# Altium schematic sheet Module.SchDoc
size A0
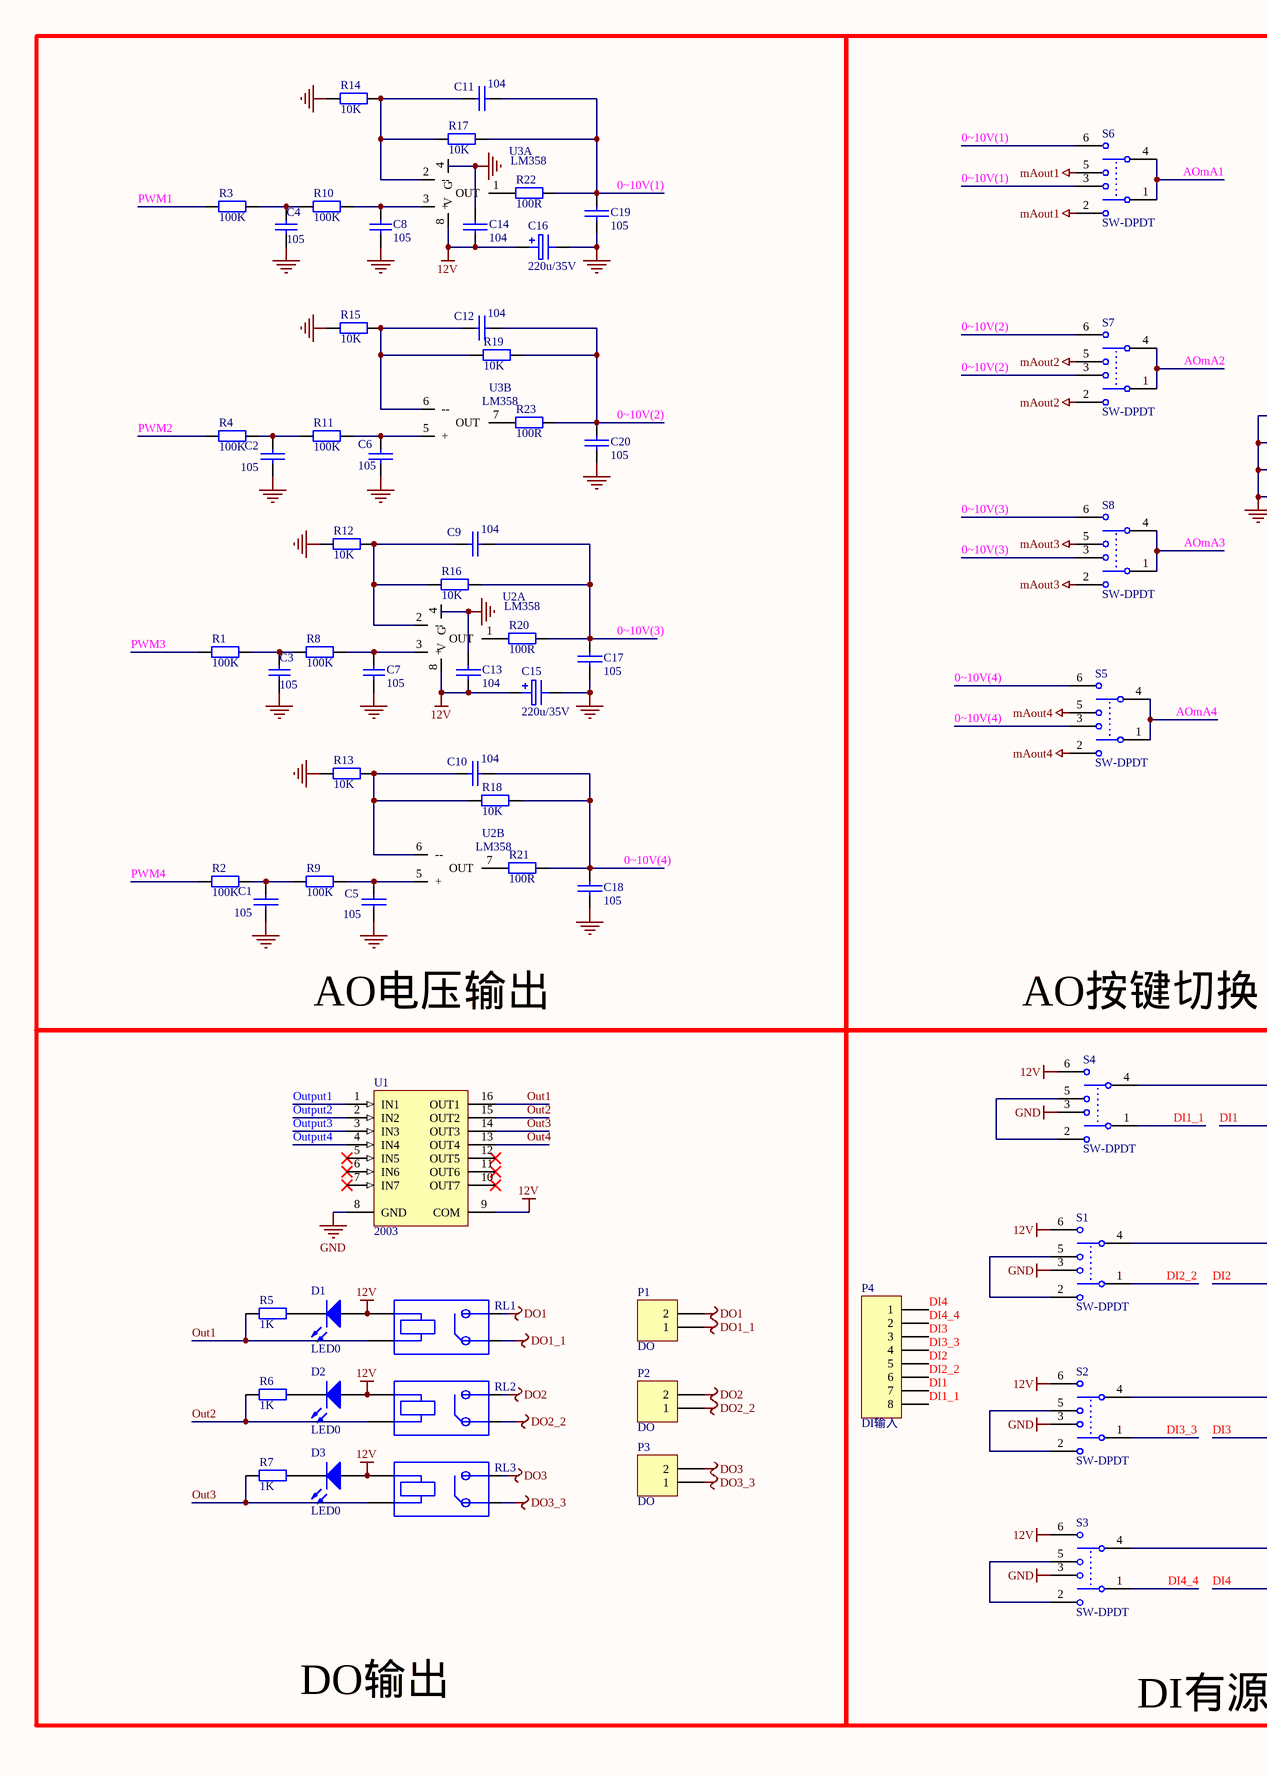
[diagram p0: Module.SchDoc, left]
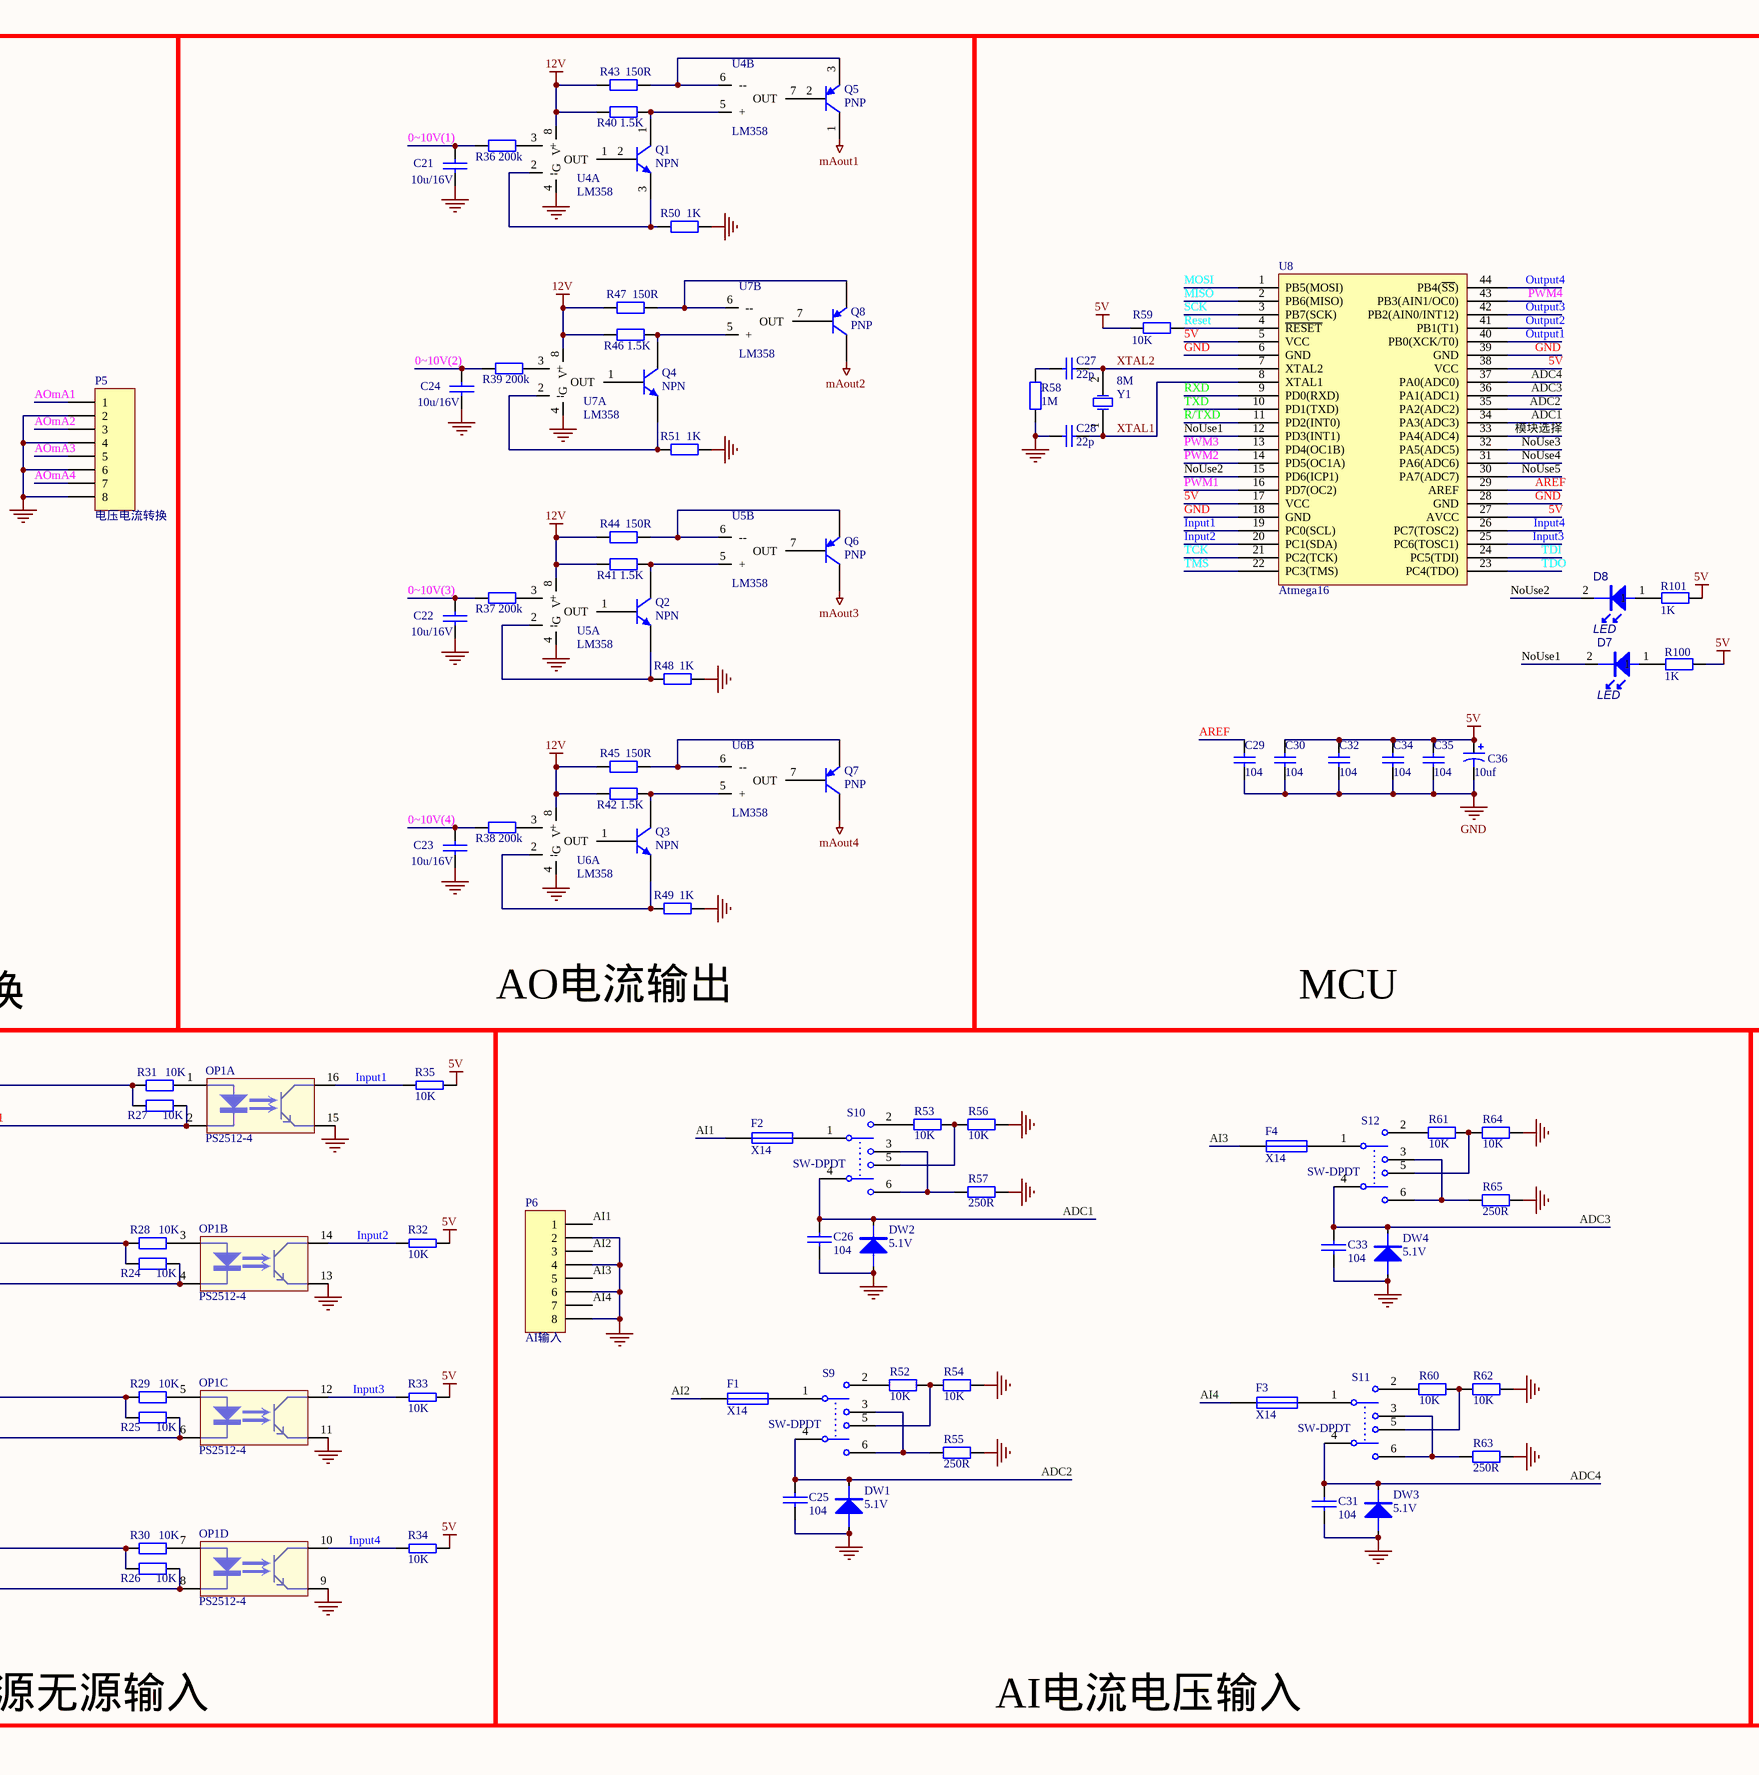
[diagram p1: Module.SchDoc, middle]
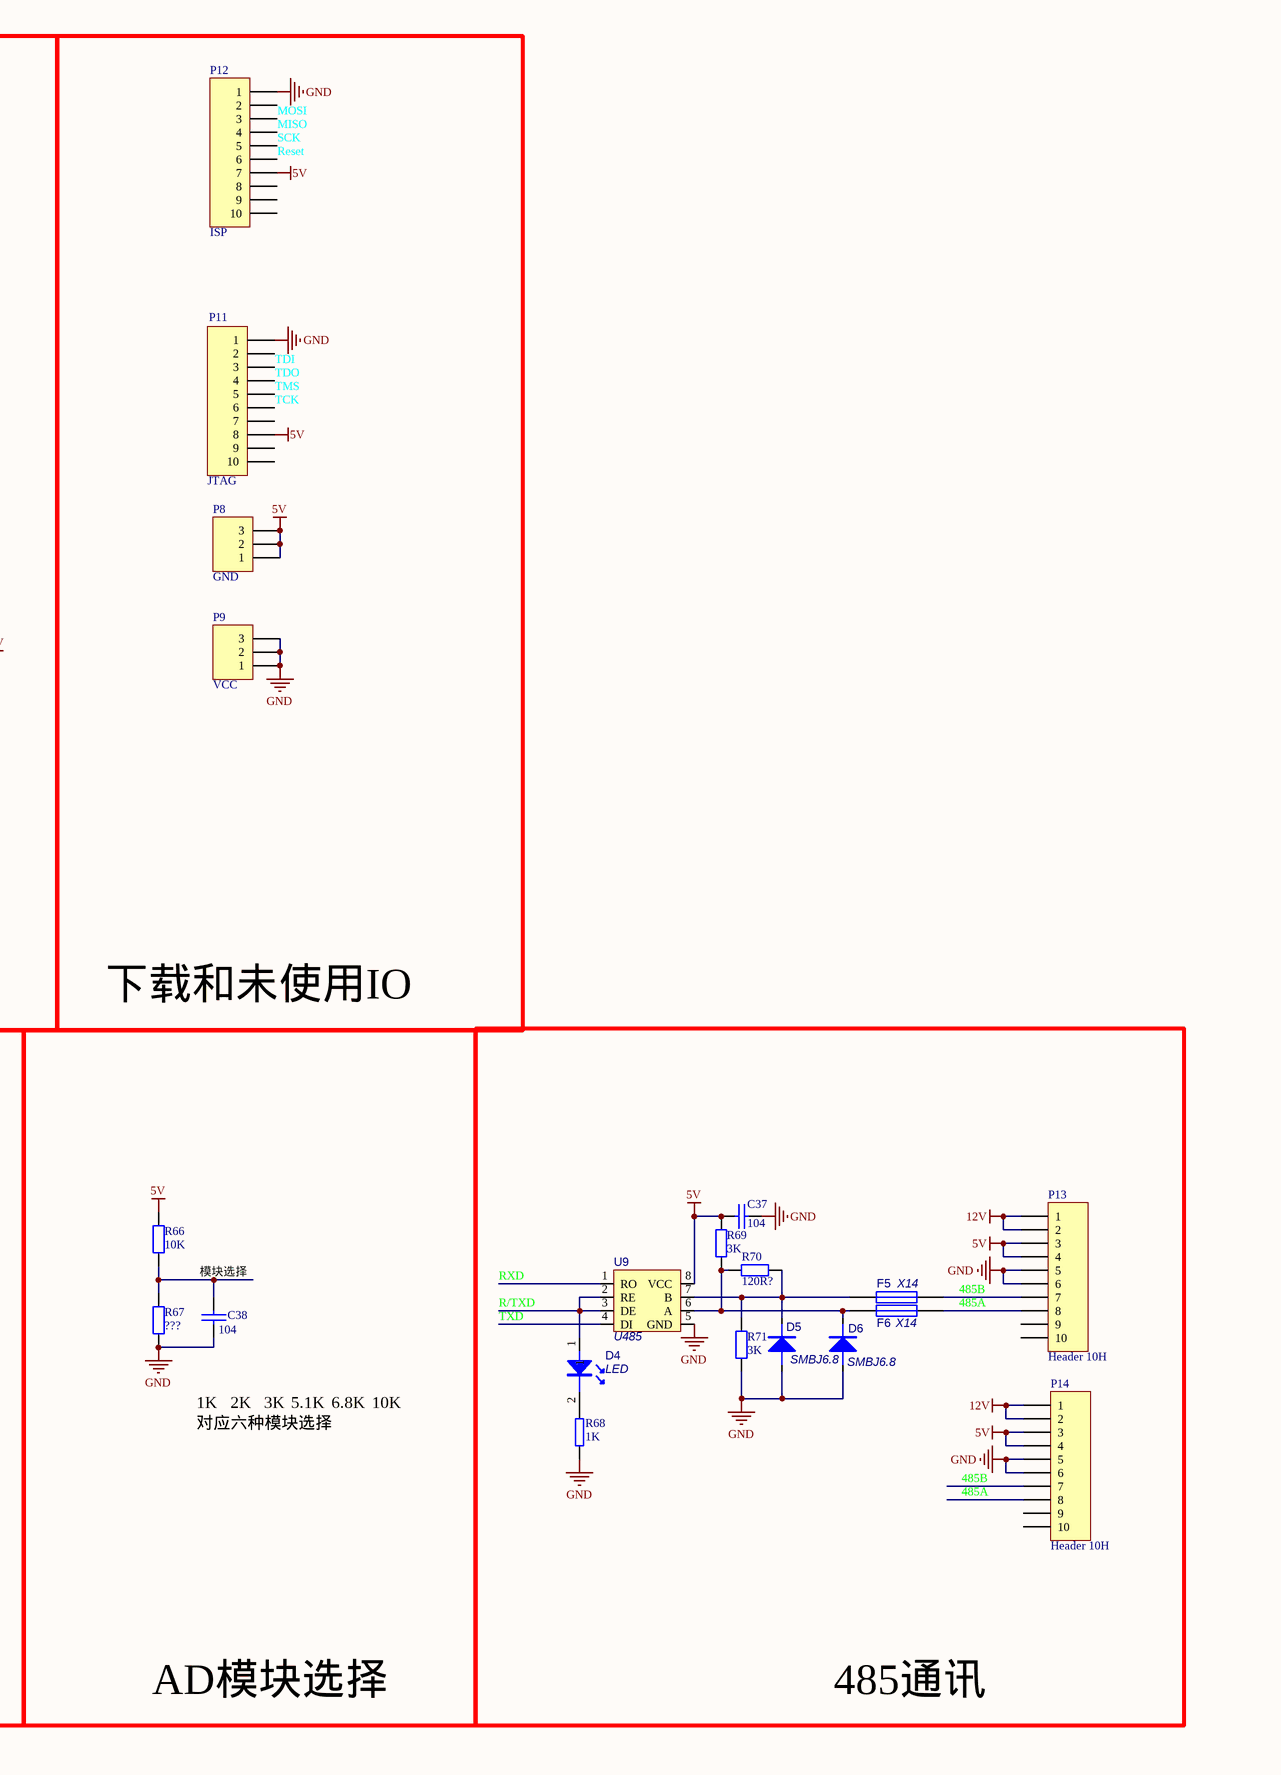
[diagram p2: Module.SchDoc, right]

## Parts
C1  105  [C0805C]
C2  105  [C0805C]
C3  105  [c0805c]
C4  105  [c0805c]
C5  105  [C0805C]
C6  105  [C0805C]
C7  105  [c0805c]
C8  105  [c0805c]
C9  104  [C0805C]
C10  104  [C0805C]
C11  104  [C0805C]
C12  104  [C0805C]
C13  104  [C0805C]
C14  104  [C0805C]
C15  220u/35V  [E8MM]
C16  220u/35V  [E8MM]
C17  105  [C0805C]
C18  105  [C0805C]
C19  105  [C0805C]
C20  105  [C0805C]
C21  10u/16V  [1206]
C22  10u/16V  [1206]
C23  10u/16V  [1206]
C24  10u/16V  [1206]
C25  104  [C0805C]
C26  104  [C0805C]
C27  22p  [c0805c]
C28  22p  [c0805c]
C29  104  [c0805c]
C30  104  [c0805c]
C31  104  [C0805C]
C32  104  [c0805c]
C33  104  [C0805C]
C34  104  [c0805c]
C35  104  [c0805c]
C36  10uf  [E6.5MM]
C37  104  [C0805C]
C38  104  [C0805C]
D1  LED0  [LED0805]
D2  LED0  [LED0805]
D3  LED0  [LED0805]
D4  LED  [LED0805]
D5  SMBJ6.8  [SMBJ_SMT]
D6  SMBJ6.8  [SMBJ_SMT]
D7  LED  [LED0805]
D8  LED  [LED0805]
DW1  5.1V  [1206AK]
DW2  5.1V  [1206AK]
DW3  5.1V  [1206AK]
DW4  5.1V  [1206AK]
F1  X14  [PPTC_SMT]
F2  X14  [PPTC_SMT]
F3  X14  [PPTC_SMT]
F4  X14  [PPTC_SMT]
F5  X14  [PPTC_SMT]
F6  X14  [PPTC_SMT]
OP1  PS2512-4  [SO_16]  (parts A,B,C,D of 4)
P1  DO  [PL2Q]
P2  DO  [PL2Q]
P3  DO  [PL2Q]
P4  DI输入  [8P _COM]
P5  电压电流转换  [8P _COM]
P6  AI输入  [8P _COM]
P8  GND  [HDR1X3]
P9  VCC  [HDR1X3]
P11  JTAG  [FC10]
P12  ISP  [FC10]
P13  Header 10H  [FC10P_wan]
P14  Header 10H  [FC10P_wan]
Q1  NPN  [SOT_23]
Q2  NPN  [SOT_23]
Q3  NPN  [SOT_23]
Q4  NPN  [SOT_23]
Q5  PNP  [SOT_23]
Q6  PNP  [SOT_23]
Q7  PNP  [SOT_23]
Q8  PNP  [SOT_23]
R1  100K  [0805R]
R2  100K  [0805R]
R3  100K  [0805R]
R4  100K  [0805R]
R5  1K  [0805R]
R6  1K  [0805R]
R7  1K  [0805R]
R8  100K  [0805R]
R9  100K  [0805R]
R10  100K  [0805R]
R11  100K  [0805R]
R12  10K  [0805R]
R13  10K  [0805R]
R14  10K  [0805R]
R15  10K  [0805R]
R16  10K  [0805R]
R17  10K  [0805R]
R18  10K  [0805R]
R19  10K  [0805R]
R20  100R  [0805R]
R21  100R  [0805R]
R22  100R  [0805R]
R23  100R  [0805R]
R24  10K  [0805R]
R25  10K  [0805R]
R26  10K  [0805R]
R27  10K  [0805R]
R28  10K  [0805R]
R29  10K  [0805R]
R30  10K  [0805R]
R31  10K  [0805R]
R32  10K  [0805R]
R33  10K  [0805R]
R34  10K  [0805R]
R35  10K  [0805R]
R36  200k  [0805R]
R37  200k  [0805R]
R38  200k  [0805R]
R39  200k  [0805R]
R40  1.5K  [0805R]
R41  1.5K  [0805R]
R42  1.5K  [0805R]
R43  150R  [0805R]
R44  150R  [0805R]
R45  150R  [0805R]
R46  1.5K  [0805R]
R47  150R  [0805R]
R48  1K  [0805R]
R49  1K  [0805R]
R50  1K  [0805R]
R51  1K  [0805R]
R52  10K  [0805R]
R53  10K  [0805R]
R54  10K  [0805R]
R55  250R  [0805R]
R56  10K  [0805R]
R57  250R  [0805R]
R58  1M  [0805R]
R59  10K  [0805R]
R60  10K  [0805R]
R61  10K  [0805R]
R62  10K  [0805R]
R63  250R  [0805R]
R64  10K  [0805R]
R65  250R  [0805R]
R66  10K  [0805R]
R67  ???  [0805R]
R68  1K  [0805R]
R69  3K  [0805R]
R70  120R?  [0805R]
R71  3K  [0805R]
R100  1K  [0805R]
R101  1K  [0805R]
RL1  (no value)  [HF32A4]
RL2  (no value)  [HF32A4]
RL3  (no value)  [HF32A4]
S1  SW-DPDT  [button]
S2  SW-DPDT  [button]
S3  SW-DPDT  [button]
S4  SW-DPDT  [button]
S5  SW-DPDT  [button]
S6  SW-DPDT  [button]
S7  SW-DPDT  [button]
S8  SW-DPDT  [button]
S9  SW-DPDT  [button]
S10  SW-DPDT  [button]
S11  SW-DPDT  [button]
S12  SW-DPDT  [button]
U1  2003  [SO_16]
U2  LM358  [SOP-08]  (parts A,B of 2)
U3  LM358  [SOP-08]  (parts A,B of 2)
U4  LM358  [SOP-08]  (parts A,B of 2)
U5  LM358  [SOP-08]  (parts A,B of 2)
U6  LM358  [SOP-08]  (parts A,B of 2)
U7  LM358  [SOP-08]  (parts A,B of 2)
U8  Atmega16  [QFP44]
U9  U485  [SOP8]
Y1  8M  [XTAL-M]

## Blocks framed on the sheet
AO电压输出: C1-C20 R1-R4 R8-R23 U2 U3
AO按键切换: P5 S5-S8
AO电流输出: C21-C24 Q1-Q8 R36-R51 U4-U7
MCU: C27-C30 C32 C34-C36 D7 D8 R58 R59 R100 R101 U8 Y1
下载和未使用IO: P8 P9 P11 P12
DI有源无源输入: OP1 P4 R24-R35 S1-S4
AI电流电压输入: C25 C26 C31 C33 DW1-DW4 F1-F4 P6 R52-R57 R60-R65 S9-S12
AD模块选择: C38 R66 R67
485通讯: C37 D4-D6 F5 F6 P13 P14 R68-R71 U9

## Nets
5V: C30.2 C32.2 C34.2 C35.1 C36.1 C37.1 P8.1 P8.2 P8.3 P11.8 P12.7 P13.3 P13.4 P14.3 P14.4 R32.2 R33.2 R34.2 R35.2 R59.2 R66.2 R69.2 R100.1 R101.1 U8.5(VCC) U8.17(VCC) U8.27(AVCC) U8.38(VCC) U9.8(VCC)
12V: C13.2 C14.2 C15.1 C16.1 D1.1(A) D2.1(A) D3.1(A) P13.1 P13.2 P14.1 P14.2 R40.2 R41.2 R42.2 R43.2 R44.2 R45.2 R46.2 R47.2 RL1.1 RL2.1 RL3.1 S1.6 S2.6 S3.6 S4.6 U1.9(COM) U2.8(V) U3.8(V) U4.8(V) U5.8(V) U6.8(V) U7.8(V)
DO1: P1.2 RL1.3
DO1_1: P1.1 RL1.4
DO2: P2.2 RL2.3
DO2_2: P2.1 RL2.4
DO3: P3.2 RL3.3
DO3_3: P3.1 RL3.4
GND: C1.2 C2.2 C3.1 C4.1 C5.2 C6.2 C7.1 C8.1 C13.1 C14.1 C15.2 C16.2 C17.2 C18.2 C19.2 C20.2 C21.2 C22.2 C23.2 C24.2 C25.2 C26.2 C28.2 C29.1 C30.1 C31.2 C32.1 C33.2 C34.1 C35.2 C36.2 C37.2 C38.2 D5.A D6.A DW1.A DW2.A DW3.A DW4.A OP1.9 OP1.11 OP1.13 OP1.15 P5.2 P5.4 P5.6 P5.8 P6.2 P6.4 P6.6 P6.8 P9.1 P9.2 P9.3 P11.1 P12.1 P13.5 P13.6 P14.5 P14.6 R12.2 R13.2 R14.2 R15.2 R48.1 R49.1 R50.1 R51.1 R54.2 R55.2 R56.2 R57.2 R58.2 R62.2 R63.2 R64.2 R65.2 R67.1 R68.1 R71.1 S1.3 S2.3 S3.3 S4.3 U1.8(GND) U4.4(G) U5.4(G) U6.4(G) U7.4(G) U8.6(GND) U8.18(GND) U8.28(GND) U8.39(GND) U9.5(GND)
mAout1: Q5.1(C) S6.2 S6.5
mAout2: Q8.1(C) S7.2 S7.5
mAout3: Q6.1(C) S8.2 S8.5
mAout4: Q7.1(C) S5.2 S5.5
0~10V(1): C11.2 C19.1 C21.1 R17.1 R22.1 R36.2 S6.3 S6.6
0~10V(2): C12.2 C20.1 C24.1 R19.1 R23.1 R39.2 S7.3 S7.6
0~10V(3): C9.2 C17.1 C22.1 R16.1 R20.1 R37.2 S8.3 S8.6
0~10V(4): C10.2 C18.1 C23.1 R18.1 R21.1 R38.2 S5.3 S5.6
485A: F6.1 P13.8 P14.8
485B: F5.1 P13.7 P14.7
ADC1: C26.1 DW2.K S10.4 U8.34(PA3(ADC3))
ADC2: C25.1 DW1.K S9.4 U8.35(PA2(ADC2))
ADC3: C33.1 DW4.K S12.4 U8.36(PA1(ADC1))
ADC4: C31.1 DW3.K S11.4 U8.37(PA0(ADC0))
AI1: F2.1 P6.1
AI2: F1.1 P6.3
AI3: F4.1 P6.5
AI4: F3.1 P6.7
AOmA1: P5.1 S6.1 S6.4
AOmA2: P5.3 S7.1 S7.4
AOmA3: P5.5 S8.1 S8.4
AOmA4: P5.7 S5.1 S5.4
AREF: C29.2 U8.29(AREF)
DI1: OP1.2 P4.7 R27.2
DI1_1: P4.8 S4.1
DI2: OP1.4 P4.5 R24.2
DI2_2: P4.6 S1.1
DI3: OP1.6 P4.3 R25.2
DI3_3: P4.4 S2.1
DI4: OP1.8 P4.1 R26.2
DI4_4: P4.2 S3.1
Input1: OP1.16 R35.1 U8.19(PC0(SCL))
Input2: OP1.14 R32.1 U8.20(PC1(SDA))
Input3: OP1.12 R33.1 U8.25(PC6(TOSC1))
Input4: OP1.10 R34.1 U8.26(PC7(TOSC2))
MISO: P12.4 U8.2(PB6(MISO))
MOSI: P12.3 U8.1(PB5(MOSI))
NoUse1: D7.2 U8.12(PD3(INT1))
NoUse2: D8.2 U8.15(PD6(ICP1))
NoUse3: U8.32(PA5(ADC5))
NoUse4: U8.31(PA6(ADC6))
NoUse5: U8.30(PA7(ADC7))
Out1: R5.2 RL1.2 U1.16(OUT1)
Out2: R6.2 RL2.2 U1.15(OUT2)
Out3: R7.2 RL3.2 U1.14(OUT3)
Out4: U1.13(OUT4)
Output1: U1.1(IN1) U8.40(PB0(XCK/T0))
Output2: U1.2(IN2) U8.41(PB1(T1))
Output3: U1.3(IN3) U8.42(PB2(AIN0/INT12))
Output4: U1.4(IN4) U8.44(PB4(~{SS}))
PWM1: R3.2 U8.16(PD7(OC2))
PWM2: R4.2 U8.14(PD5(OC1A))
PWM3: R1.2 U8.13(PD4(OC1B))
PWM4: R2.2 U8.43(PB3(AIN1/OC0))
R/TXD: D4.1 U8.11(PD2(INT0)) U9.2(RE) U9.3(DE)
Reset: P12.6 R59.1 U8.4(~{RESET})
RXD: U8.9(PD0(RXD)) U9.1(RO)
SCK: P12.5 U8.3(PB7(SCK))
TCK: P11.6 U8.21(PC2(TCK))
TDI: P11.3 U8.24(PC5(TDI))
TDO: P11.4 U8.23(PC4(TDO))
TMS: P11.5 U8.22(PC3(TMS))
TXD: U8.10(PD1(TXD)) U9.4(DI)
XTAL1: C28.1 U8.8(XTAL1) Y1.1(OSC1)
XTAL2: C27.1 U8.7(XTAL2) Y1.2(OSC2)
模块选择: C38.1 R66.1 R67.2 U8.33(PA4(ADC4))
NetC1_1: C1.1 R2.1 R9.2
NetC2_1: C2.1 R4.1 R11.2
NetC3_2: C3.2 R1.1 R8.2
NetC4_2: C4.2 R3.1 R10.2
NetC5_1: C5.1 R9.1 U2.5(+)
NetC6_1: C6.1 R11.1 U3.5(+)
NetC7_2: C7.2 R8.1 U2.3(+)
NetC8_2: C8.2 R10.1 U3.3(+)
NetC9_1: C9.1 R12.1 R16.2 U2.2(--)
NetC10_1: C10.1 R13.1 R18.2 U2.6(--)
NetC11_1: C11.1 R14.1 R17.2 U3.2(--)
NetC12_1: C12.1 R15.1 R19.2 U3.6(--)
NetC27_2: C27.2 R58.1
NetD1_2: D1.2(K) R5.1
NetD2_2: D2.2(K) R6.1
NetD3_2: D3.2(K) R7.1
NetD4_2: D4.2 R68.2
NetD5_K: D5.K F5.2 R70.2 R71.2 U9.7(B)
NetD6_K: D6.K F6.2 R69.1 R70.1 U9.6(A)
NetD7_1: D7.1 R100.2
NetD8_1: D8.1 R101.2
NetF1_2: F1.2 S9.1
NetF2_2: F2.2 S10.1
NetF3_2: F3.2 S11.1
NetF4_2: F4.2 S12.1
NetOP1_1: OP1.1 R31.2
NetOP1_3: OP1.3 R28.2
NetOP1_5: OP1.5 R29.2
NetOP1_7: OP1.7 R30.2
NetQ1_1: Q1.1(C) R40.1 U4.5(+)
NetQ1_2: Q1.2(B) U4.1(OUT)
NetQ1_3: Q1.3(E) R50.2 U4.2(--)
NetQ2_1: Q2.1(C) R41.1 U5.5(+)
NetQ2_2: Q2.2(B) U5.1(OUT)
NetQ2_3: Q2.3(E) R48.2 U5.2(--)
NetQ3_1: Q3.1(C) R42.1 U6.5(+)
NetQ3_2: Q3.2(B) U6.1(OUT)
NetQ3_3: Q3.3(E) R49.2 U6.2(--)
NetQ4_1: Q4.1(C) R46.1 U7.5(+)
NetQ4_2: Q4.2(B) U7.1(OUT)
NetQ4_3: Q4.3(E) R51.2 U7.2(--)
NetQ5_2: Q5.2(B) U4.7(OUT)
NetQ5_3: Q5.3(E) R43.1 U4.6(--)
NetQ6_2: Q6.2(B) U5.7(OUT)
NetQ6_3: Q6.3(E) R44.1 U5.6(--)
NetQ7_2: Q7.2(B) U6.7(OUT)
NetQ7_3: Q7.3(E) R45.1 U6.6(--)
NetQ8_2: Q8.2(B) U7.7(OUT)
NetQ8_3: Q8.3(E) R47.1 U7.6(--)
NetR20_2: R20.2 U2.1(OUT)
NetR21_2: R21.2 U2.7(OUT)
NetR22_2: R22.2 U3.1(OUT)
NetR23_2: R23.2 U3.7(OUT)
NetR24_1: R24.1 R28.1 S1.4
NetR25_1: R25.1 R29.1 S2.4
NetR26_1: R26.1 R30.1 S3.4
NetR27_1: R27.1 R31.1 S4.4
NetR36_1: R36.1 U4.3(+)
NetR37_1: R37.1 U5.3(+)
NetR38_1: R38.1 U6.3(+)
NetR39_1: R39.1 U7.3(+)
NetR52_1: R52.1 S9.2
NetR52_2: R52.2 R54.1 S9.5
NetR53_1: R53.1 S10.2
NetR53_2: R53.2 R56.1 S10.5
NetR55_1: R55.1 S9.3 S9.6
NetR57_1: R57.1 S10.3 S10.6
NetR60_1: R60.1 S11.2
NetR60_2: R60.2 R62.1 S11.5
NetR61_1: R61.1 S12.2
NetR61_2: R61.2 R64.1 S12.5
NetR63_1: R63.1 S11.3 S11.6
NetR65_1: R65.1 S12.3 S12.6
NetS1_2: S1.2 S1.5
NetS2_2: S2.2 S2.5
NetS3_2: S3.2 S3.5
NetS4_2: S4.2 S4.5

Not connected (* = marked no-connect by the designer): P11 2 7 9 10; P12 2 8 9 10; P13 9 10; P14 9 10; U1 5(IN5)* 6(IN6)* 7(IN7)* 10(OUT7)* 11(OUT6)* 12(OUT5)*; U2 4(G); U3 4(G)

## Notes on the sheet
- 1K
- 2K
- 3K
- 5.1K
- 6.8K
- 10K
- 对应六种模块选择
- DO输出

## Library data of the parts
C1 C2 C5 C6 C17-C24 = CAP: Capacitor; 采购信息: 1uF 25V X7R,5%,50V,贴片电容 0805
C3 C4 C7 C8 = Cap: Capacitor; Value: 104; Published: 8-Jun-2000; LatestRevisionDate: 17-Jul-2002; LatestRevisionNote: Re-released for DXP Platform.; Publisher: Altium Limited
C9-C14 = CAP: Capacitor; 采购信息: X7R,5%,50V,贴片电容
C15 C16 = ELECTRO1: Electrolytic Capacitor; 采购信息: 1000uf/25V 插件电解电容
C25 C26 C31 C33 C38 = CAP: Capacitor
C27-C30 C32 C34 C35 = Cap: Capacitor; Published: 8-Jun-2000; LatestRevisionDate: 17-Jul-2002; LatestRevisionNote: Re-released for DXP Platform.; Publisher: Altium Limited
  C27 C28: Value: 22P
  C29 C30 C32 C34 C35: Value: 104
C36 = Cap Pol1: Polarized Capacitor (Radial); Published: 8-Jun-2000; LatestRevisionDate: 17-Jul-2002; LatestRevisionNote: Re-released for DXP Platform.; Publisher: Altium Limited; Value: 10uf
C37 = CAP: Capacitor; 采购信息: 0.1uF 25V X7R,5%,50V,贴片电容 0805
D1-D3 = LED0: Typical INFRARED GaAs LED; Published: 8-Jun-2000; LatestRevisionDate: 08-Jul-2005; LatestRevisionNote: Mech Layer 1 removed.; PackageReference: LED-0; Publisher: Altium Limited; PackageDescription: LED; 2 Leads
D5 D6 DW1-DW4 = DIODE
F1-F6 = Fuse 1: Fuse; Published: 8-Jun-2000; LatestRevisionDate: 17-Jul-2002; LatestRevisionNote: Re-released for DXP Platform.; PackageReference: PIN-W2/E2.8; Publisher: Altium Limited
P1-P3 = Header 2: Header, 2-Pin; 采购信息: 环保，绿色，两边密闭，180度，两位; LatestRevisionDate: 17-Jul-2002; LatestRevisionNote: Re-released for DXP Platform.; Publisher: Altium Limited
P4-P6 = Header 8: Header, 8-Pin; LatestRevisionDate: 17-Jul-2002; LatestRevisionNote: Re-released for DXP Platform.; Publisher: Altium Limited
P8 P9 = Header 3: Header, 3-Pin; LatestRevisionDate: 17-Jul-2002; LatestRevisionNote: Re-released for DXP Platform.; Publisher: Altium Limited
P11-P14 = Header 10H: Header, 10-Pin, Right Angle; LatestRevisionDate: 17-Jul-2002; LatestRevisionNote: Re-released for DXP Platform.; Publisher: Altium Limited
Q1-Q4 = NPN: NPN Bipolar Transistor; Published: 8-Jun-2000; LatestRevisionDate: 17-Jul-2002; LatestRevisionNote: Re-released for DXP Platform.; PackageReference: TO-226; Publisher: Altium Limited; Code_JEDEC: TO-226-AA
Q5-Q8 = PNP: PNP Bipolar Transistor; Published: 8-Jun-2000; LatestRevisionDate: 17-Jul-2002; LatestRevisionNote: Re-released for DXP Platform.; PackageReference: SOT-23B; Publisher: Altium Limited; Code_JEDEC: SOT-23
R1-R4 R8-R31 R36-R47 R52-R67 R69-R71 = Res2: Resistor; Value: 1K; Published: 8-Jun-2000; LatestRevisionDate: 17-Jul-2002; LatestRevisionNote: Re-released for DXP Platform.; PackageReference: AXIAL-0.4; Publisher: Altium Limited; PackageDescription: Axial Device, Thru-Hole; 2 Leads; 0.4 in Pin Spacing
R5-R7 R48-R51 R100 R101 = Res2: Resistor; Published: 8-Jun-2000; LatestRevisionDate: 17-Jul-2002; LatestRevisionNote: Re-released for DXP Platform.; PackageReference: AXIAL-0.4; Publisher: Altium Limited; PackageDescription: Axial Device, Thru-Hole; 2 Leads; 0.4 in Pin Spacing; Value: 1K
R32-R35 R68 = res
RL1-RL3 = RELAY
S1-S12 = SW-DPDT: Double-Pole, Double-Throw Switch; Published: 24-Mar-1999; LatestRevisionDate: 17-Jul-2002; LatestRevisionNote: Re-released for DXP Platform.; PackageReference: DPDT-6; Publisher: Altium Limited; PackageDescription: Switch; 6 Leads
U1 = ULN2003A: High-Voltage, High-Current Darlington Array; Published: *; LatestRevisionDate: *; LatestRevisionNote: *; DatasheetVersion: *; PackageVersion: *; PackageReference: *; Publisher: *; PackageDescription: *; Code_JEDEC: *; ComponentLink1Description: *; ComponentLink1URL: *
U2-U7 = LM358: 采购信息: 贴片 LM358
Y1 = XTAL: Crystal Oscillator; Published: 8-Jun-2000; LatestRevisionDate: 17-Jul-2002; LatestRevisionNote: Re-released for DXP Platform.; Publisher: Altium Limited